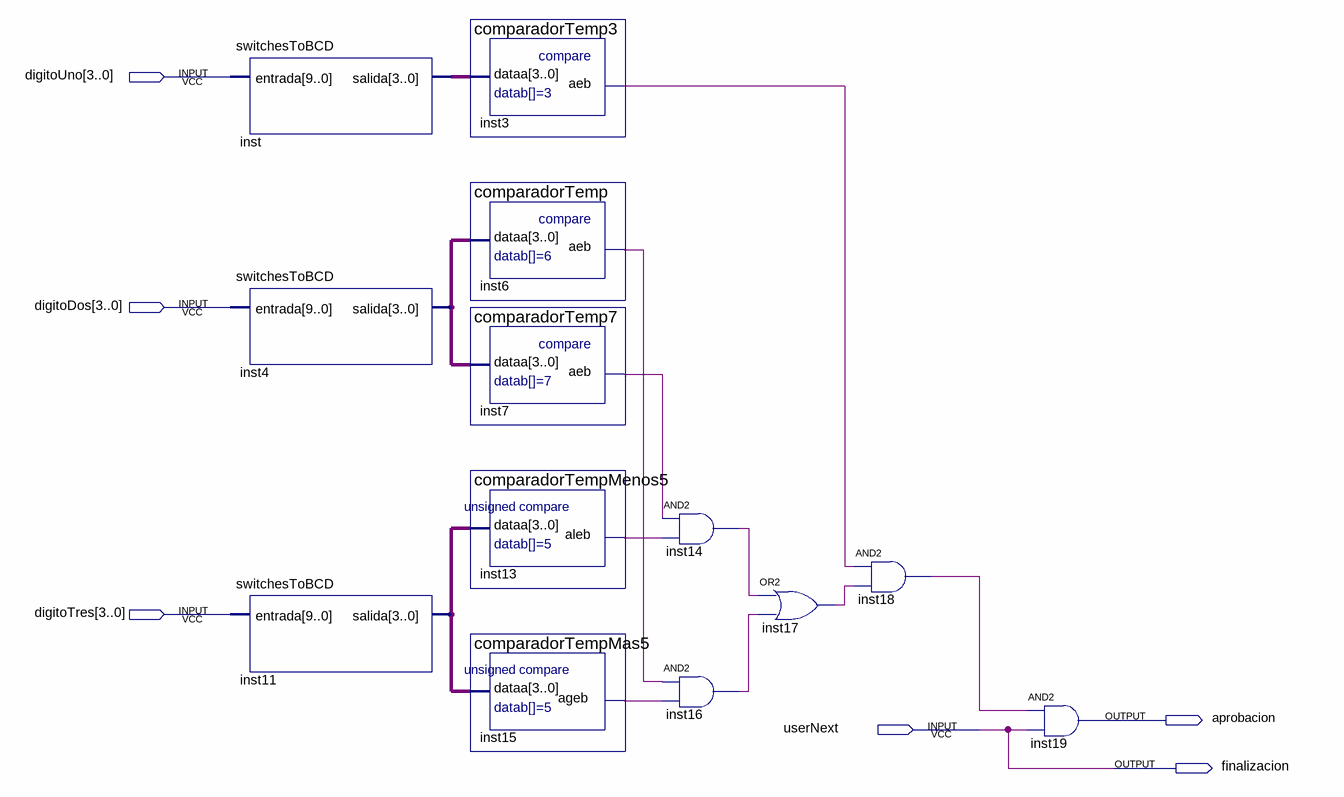
[diagram p0: schematic sheet]
// Quartus schematic procesoTres.bdf as structural Verilog: 13 symbols, 6 pins
module procesoTres (
  input  [3:0] digitoUno,
  input  [3:0] digitoDos,
  input  [3:0] digitoTres,
  input  userNext,
  output aprobacion,
  output finalizacion
);

  wire inst3_aeb, inst6_aeb, inst7_aeb, inst13_aleb, inst14_out, inst15_ageb, inst16_out, inst17_out,
       inst18_out;
  wire [3:0] inst4_salida, inst11_salida, inst_salida;

  switchesToBCD inst (.entrada(digitoUno), .salida(inst_salida));
  switchesToBCD inst4 (.entrada(digitoDos), .salida(inst4_salida));
  switchesToBCD inst11 (.entrada(digitoTres), .salida(inst11_salida));
  comparadorTemp3 inst3 (.dataa(inst_salida), .aeb(inst3_aeb));
  comparadorTemp inst6 (.dataa(inst4_salida), .aeb(inst6_aeb));
  comparadorTemp7 inst7 (.dataa(inst4_salida), .aeb(inst7_aeb));
  comparadorTempMenos5 inst13 (.dataa(inst11_salida), .aleb(inst13_aleb));
  comparadorTempMas5 inst15 (.dataa(inst11_salida), .ageb(inst15_ageb));
  and inst14 (inst14_out, inst7_aeb, inst13_aleb);
  and inst16 (inst16_out, inst6_aeb, inst15_ageb);
  or inst17 (inst17_out, inst14_out, inst16_out);
  and inst18 (inst18_out, inst3_aeb, inst17_out);
  and inst19 (aprobacion, inst18_out, userNext);

  assign finalizacion = userNext;
endmodule
